# EAGLE design Uniformity Sensor (EAGLE 7.5.0)
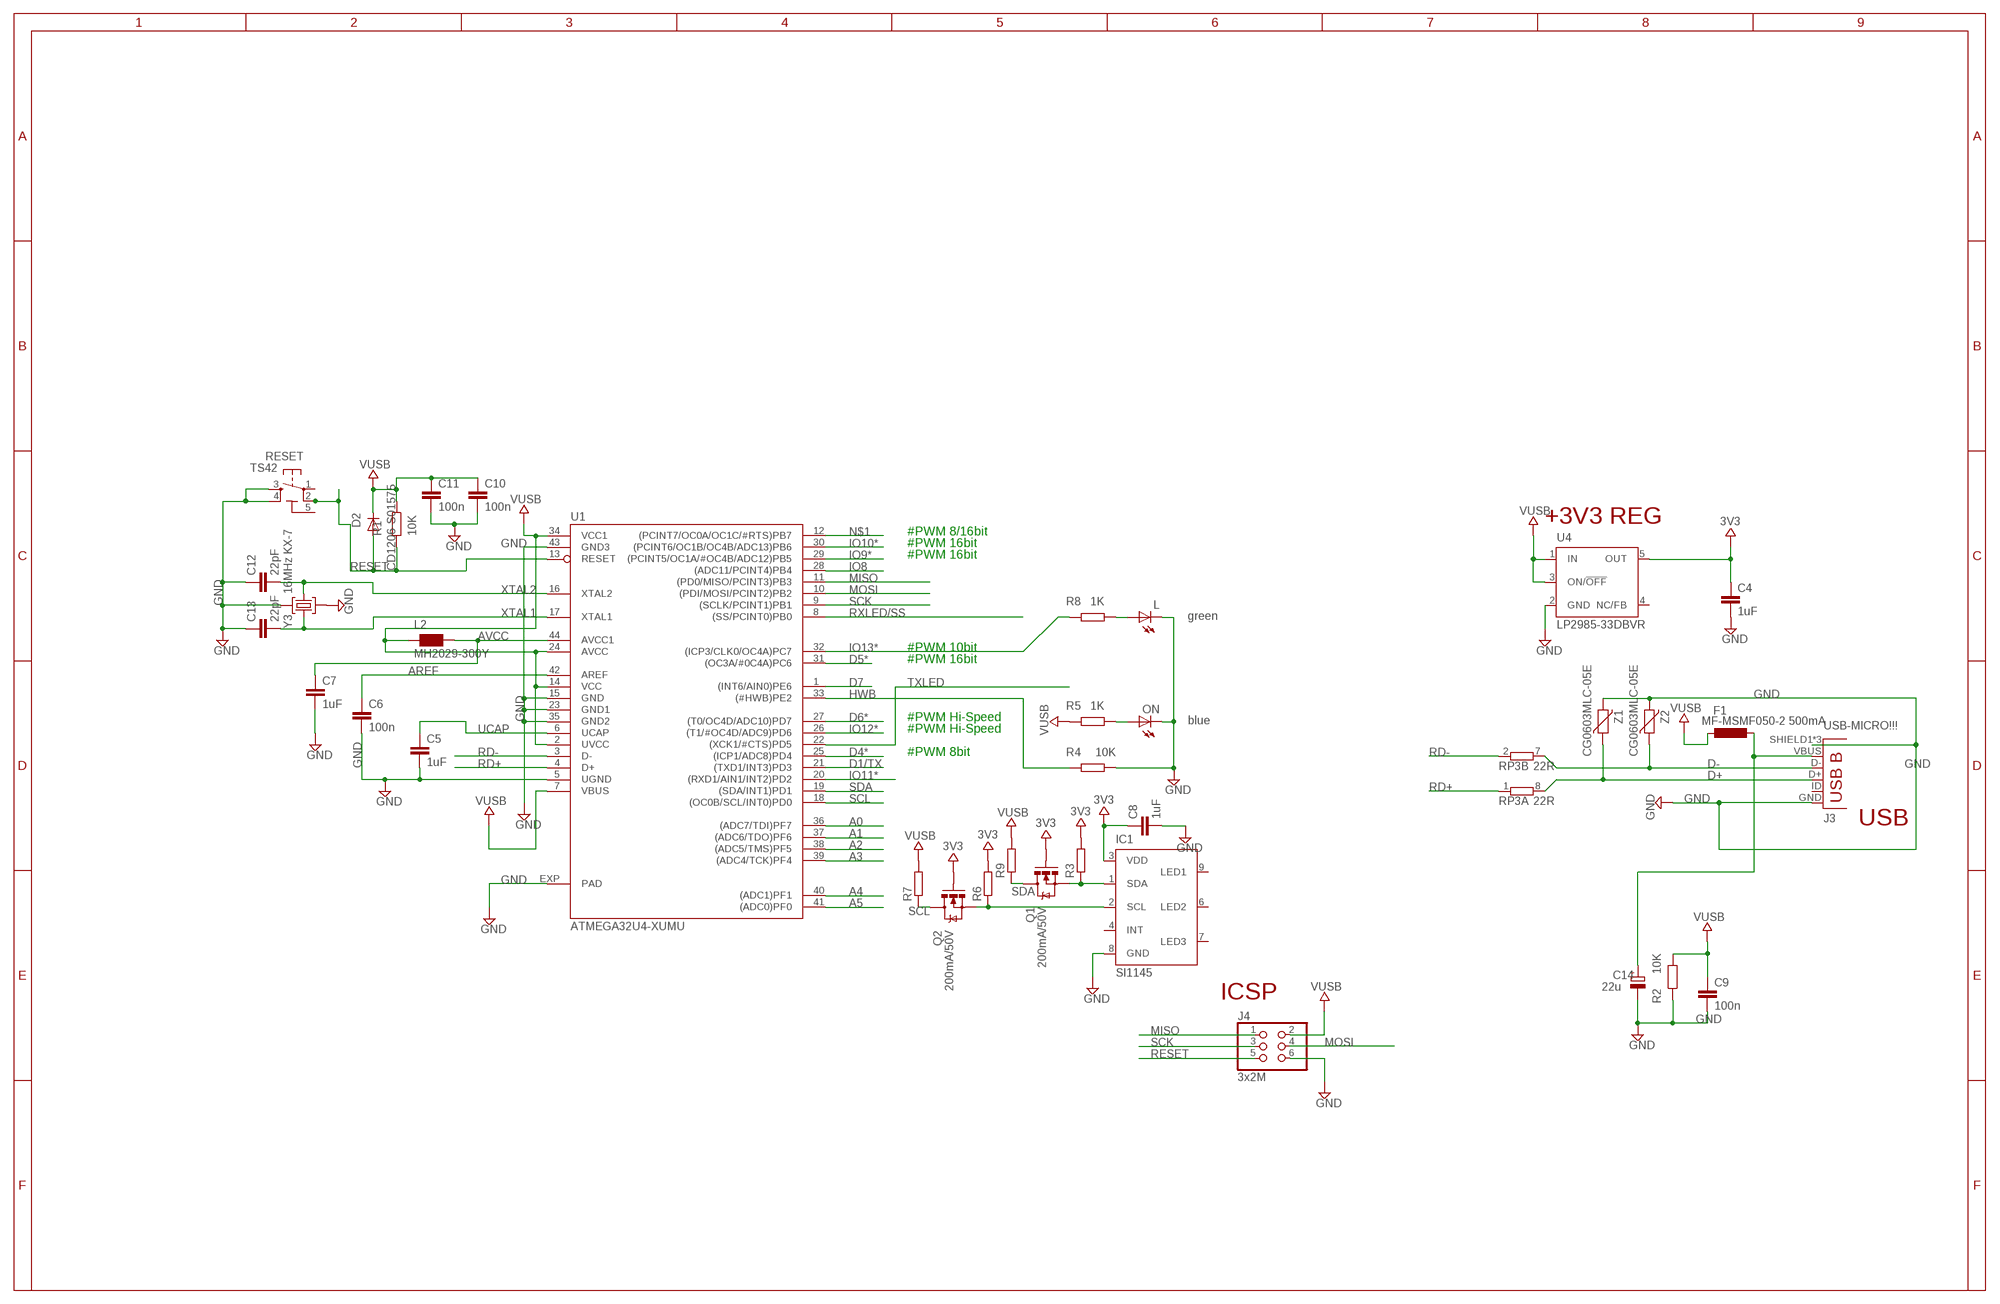
[diagram p0: schematic, sheet 1]

## Parts
C4  1uF  C-EUC0402  [C0402]
C5  1uF  SMARTPRJ_C-EUC0603  [SMARTPRJ_C0603-ROUND]
C6  100n  C-EUC0402  [C0402]
C7  1uF  C-EUC0402  [C0402]
C8  1uF  C-EUC0402  [C0402]
C9  100n  C-EUC0402  [C0402]
C10  100n  C-EUC0402  [C0402]
C11  100n  C-EUC0402  [C0402]
C12  22pF  C-EUC0402  [C0402]
C13  22pF  C-EUC0402  [C0402]
C14  22u  CPOL-EUSMCB  [SMC_B]
D2  CD1206-S01575  DIODE-MINIMELF  [MINIMELF]
F1  MF-MSMF050-2 500mA  L-EUL1812  [L1812]
IC1  SI1145  [QFN-10]
J3  USB-MICRO!!!  USB-MICROB"  [USB-B-MICRO-SMD_V03]
J4  3x2M  PINHD-2X3  [2X03]
L  green  LEDCHIPLED_0805  [CHIPLED_0805]
L2  MH2029-300Y  WE-CBF_0805  [0805]
ON  blue  LEDCHIPLED_0805  [CHIPLED_0805]
Q1  200mA/50V  MOSFET-NCHANNELBSS138  [SOT23-3]
Q2  200mA/50V  MOSFET-NCHANNELBSS138  [SOT23-3]
R1  10K  R-EU_R0402  [R0402]
R2  10K  R-EU_R0402  [R0402]
R3  SMARTPRJ_R-EU_R0402  [SMARTPRJ_R0402]
R4  10K  R-EU_R0402  [R0402]
R5  1K  R-EU_R0402  [R0402]
R6  SMARTPRJ_R-EU_R0402  [SMARTPRJ_R0402]
R7  SMARTPRJ_R-EU_R0603  [SMARTPRJ_R0603-ROUND]
R8  1K  R-EU_R0402  [R0402]
R9  SMARTPRJ_R-EU_R0402  [SMARTPRJ_R0402]
RESET  TS42  [TS42]
RP3  22R  4R-NCAY16  [CAY16]
U1  ATMEGA32U4-XUMU  [QFN44ML7X7]
U4  LP2985-33DBVR  LP2985-XXDBVR33  [SOT23-DBV]
Y3  16MHz KX-7  CRYSTAL-3.2-2.5  [CRYSTAL-3.2-2.5]
Z1  CG0603MLC-05E  VARISTORCN0603  [CT/CN0603]
Z2  CG0603MLC-05E  VARISTORCN0603  [CT/CN0603]

## Nets
3V3: C4.1 C8.1 IC1.3(VDD) Q1.1(G) Q2.1(G) R3.2 R6.2 U4.5(OUT)
A0: U1.36((ADC7/TDI)PF7)
A1: U1.37((ADC6/TDO)PF6)
A2: U1.38((ADC5/TMS)PF5)
A3: U1.39((ADC4/TCK)PF4)
A4: U1.40((ADC1)PF1)
A5: U1.41((ADC0)PF0)
AREF: C6.1 U1.42(AREF)
AVCC: C7.1 L2.2 U1.44(AVCC1)
D1/TX: U1.21((TXD1/INT3)PD3)
D4*: U1.25((ICP1/ADC8)PD4)
D5*: U1.31((OC3A/#0C4A)PC6)
D6*: U1.27((T0/OC4D/ADC10)PD7)
D7: U1.1((INT6/AIN0)PE6)
D+: J3.D+ RP3.8 Z1.1
D-: J3.D- RP3.7 Z2.1
GND: C4.2 C5.2 C6.2 C7.2 C8.2 C9.2 C10.2 C11.2 C12.1 C13.1 C14.- IC1.8(GND) J3.GND J3.SHIELD1(SHIELD) J3.SHIELD2(SHIELD) J3.SHIELD3(SHIELD) J4.6 L.C ON.C R2.1 R4.2 RESET.3 RESET.4 U1.5(UGND) U1.15(GND) U1.23(GND1) U1.35(GND2) U1.43(GND3) U1.EXP(PAD) U4.2(GND) Y3.2(GND) Y3.4(GND) Z1.2 Z2.2
HWB: R4.1 U1.33((#HWB)PE2)
IO8: U1.28((ADC11/PCINT4)PB4)
IO9*: U1.29((PCINT5/OC1A/#OC4B/ADC12)PB5)
IO10*: U1.30((PCINT6/OC1B/OC4B/ADC13)PB6)
IO11*: U1.20((RXD1/AIN1/INT2)PD2)
IO12*: U1.26((T1/#OC4D/ADC9)PD6)
IO13*: R8.1 U1.32((ICP3/CLK0/OC4A)PC7)
MISO: J4.1 U1.11((PD0/MISO/PCINT3)PB3)
MOSI: J4.4 U1.10((PDI/MOSI/PCINT2)PB2)
N$1: U1.12((PCINT7/OC0A/OC1C/#RTS)PB7)
N$2: IC1.1(SDA) Q1.2(S) R3.1
N$3: ON.A R5.2
N$4: IC1.2(SCL) Q2.2(S) R6.1
N$7: L.A R8.2
RD+: RP3.1 U1.4(D+)
RD-: RP3.2 U1.3(D-)
RESET: D2.A J4.5 R1.2 RESET.2 U1.13(RESET)
RXLED/SS: U1.8((SS/PCINT0)PB0)
SCK: J4.3 U1.9((SCLK/PCINT1)PB1)
SCL: Q2.3(D) R7.1 U1.18((OC0B/SCL/INT0)PD0)
SDA: Q1.3(D) R9.1 U1.19((SDA/INT1)PD1)
TXLED: U1.22((XCK1/#CTS)PD5)
UCAP: C5.1 U1.6(UCAP)
VUSB: C9.1 C10.1 C11.1 D2.C F1.2 J4.2 L2.1 R1.1 R2.2 R5.1 R7.2 R9.2 U1.2(UVCC) U1.7(VBUS) U1.14(VCC) U1.24(AVCC) U1.34(VCC1) U4.1(IN) U4.3(ON/!OFF)
VUSBD: C14.+ F1.1 J3.VBUS
XTAL1: C13.2 U1.17(XTAL1) Y3.3(C2)
XTAL2: C12.2 U1.16(XTAL2) Y3.1(C1)
Unconnected: IC1.4(INT) IC1.6(LED2) IC1.7(LED3) IC1.9(LED1) J3.ID(USBID) RESET.1 RP3.3 RP3.4 RP3.5 RP3.6 U4.4(NC/FB)

## Notes on the sheet
- +3V3 REG
- #PWM 8/16bit
- #PWM 16bit
- #PWM 16bit
- #PWM 10bit
- #PWM 16bit
- #PWM Hi-Speed
- #PWM Hi-Speed
- #PWM 8bit
- USB
- ICSP

## Power pins joined to a net without a drawn wire
5-GND: RESET.5(5-GND)

## Library data of the parts
C4 C6-C13 = SmartPrj:C-EU: CAPACITOR, European symbol
C5 = arduino-micro-reference-designArduino_Micro_Rev03j:SMARTPRJ_C-EU: CAPACITOR, European symbol
C14 = rcl:CPOL-EU: POLARIZED CAPACITOR, European symbol
D2 = diode:DIODE-: DIODE
F1 = rcl:L-EU: INDUCTOR, European symbol
IC1 = silabs:SI114*: PROXIMITY/UV/AMBIENT LIGHT SENSOR IC WITH I2C INTERFACE Source: http://www.silabs.com/Support%20Documents/TechnicalDocs/Si1145-46-47.pdf
J3 = SparkFun-Connectors:USB-MICROB; PROD_ID: CONN-11752
J4 = SmartPrj:PINHD-2X3: PIN HEADER
L ON = led:LED: LED OSRAM: - CHIPLED LG R971, LG N971, LY N971, LG Q971, LY Q971, LO R971, LY R971 LH N974, LH R974 LS Q976, LO Q976, LY Q976 LO Q996 - Hyper CHIPLED LW Q18S LB Q993, LB Q99A, LB R99A - SideLED LS A670, LO A670, LY A670, LG A670, LP A670 LB A673, LV A673, LT A673, LW A673 LH A674 LY A675 LS A676, LA A676, LO A676, LY A676, LW A676 LS A679, LY A679, LG A679 - Hyper Micro SIDELED® LS Y876, LA Y876, LO Y876, LY Y876 LT Y87S - SmartLED LW L88C, LW L88S LB L89C, LB L89S, LG L890 LS L89K, LO L89K, LY L89K LS L896, LA L896, LO L896, LY L896 - TOPLED LS T670, LO T670, LY T670, LG T670, LP T670 LSG T670, LSP T670, LSY T670, LOP T670, LYG T670 LG T671, LOG T671, LSG T671 LB T673, LV T673, LT T673, LW T673 LH T674 LS T676, LA T676, LO T676, LY T676, LB T676, LH T676, LSB T676, LW T676 LB T67C, LV T67C, LT T67C, LS T67K, LO T67K, LY T67K, LW E67C LS E67B, LA E67B, LO E67B, LY E67B, LB E67C, LV E67C, LT E67C LW T67C LS T679, LY T679, LG T679 LS T770, LO T770, LY T770, LG T770, LP T770 LB T773, LV T773, LT T773, LW T773 LH T774 LS E675, LA E675, LY E675, LS T675 LS T776, LA T776, LO T776, LY T776, LB T776 LHGB T686 LT T68C, LB T68C - Hyper Mini TOPLED® LB M676 - Mini TOPLED Santana® LG M470 LS M47K, LO M47K, LY M47K Source: http://www.osram.convergy.de LUXEON: - LUMILED® LXK2-PW12-R00, LXK2-PW12-S00, LXK2-PW14-U00, LXK2-PW14-V00 LXK2-PM12-R00, LXK2-PM12-S00, LXK2-PM14-U00 LXK2-PE12-Q00, LXK2-PE12-R00, LXK2-PE12-S00, LXK2-PE14-T00, LXK2-PE14-U00 LXK2-PB12-K00, LXK2-PB12-L00, LXK2-PB12-M00, LXK2-PB14-N00, LXK2-PB14-P00, LXK2-PB14-Q00 LXK2-PR12-L00, LXK2-PR12-M00, LXK2-PR14-Q00, LXK2-PR14-R00 LXK2-PD12-Q00, LXK2-PD12-R00, LXK2-PD12-S00 LXK2-PH12-R00, LXK2-PH12-S00 LXK2-PL12-P00, LXK2-PL12-Q00, LXK2-PL12-R00 Source: www.luxeon.com KINGBRIGHT: KA-3528ASYC Source: www.kingbright.com
L2 = wuerth-elektronik:WE-CBF: SMD EMI Suppression Ferrite Beads - excellent anti-EMI properties - low DCR - impedances till 3000 ohms - rated current up to 6 A
Q1 Q2 = SparkFun-DiscreteSemi:MOSFET-NCHANNEL: Common NMOSFET Parts MFG P/N Store ID Prod ID FDD8780 TRANS-09984 SI7820DN TRANS-11055 FDS6630A IC-08089 2N7002PW TRANS-11151 FQP30N06L COM-10213 TRANS-10060 BSS123LT1G TRANS-08345 BSS138 TRANS-00830 BS170 2N7000; PROD_ID: TRANS-00830
R1 R2 R4 R5 R8 = SmartPrj:R-EU_: RESISTOR, European symbol
R3 R6 R7 R9 = arduino-micro-reference-designArduino_Micro_Rev03j:SMARTPRJ_R-EU_: RESISTOR, European symbol
RESET = SmartPrj:TS42: TS42 Dongnan Electronics Tact switch VDC 12V - 50mA
RP3 = resistor-dil:4R-N: Array Chip Resistor Source: RS Component / Phycomp
U1 = SmartPrj:ATMEGA32U4-XU
U4 = SmartPrj:LP2985-XXDBVR: ULTRALOW-POWER 50-mA LOW-DROPOUT LINEAR REGULATORS 50-mA Low-Dropout Regulator Source: http://focus.ti.com/lit/ds/symlink/tps77001.pdf
Y3 = SmartPrj:CRYSTAL-3.2-2.5
Z1 Z2 = varistor:VARISTOR: VARISTOR

## Net classes
0 default: width 0.254 mm, drill 0.61 mm, clearance 0.203 mm

## Board
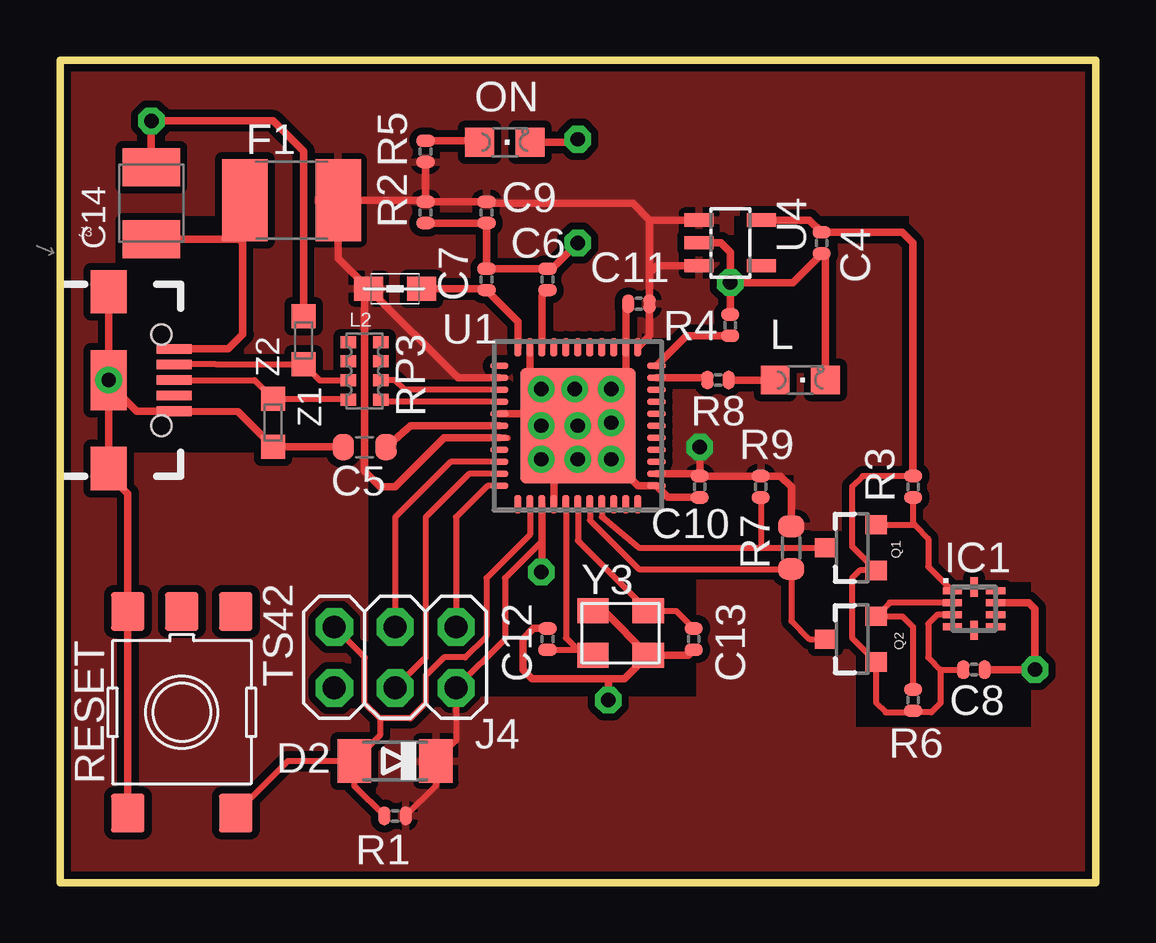
[diagram p1: board, top side]
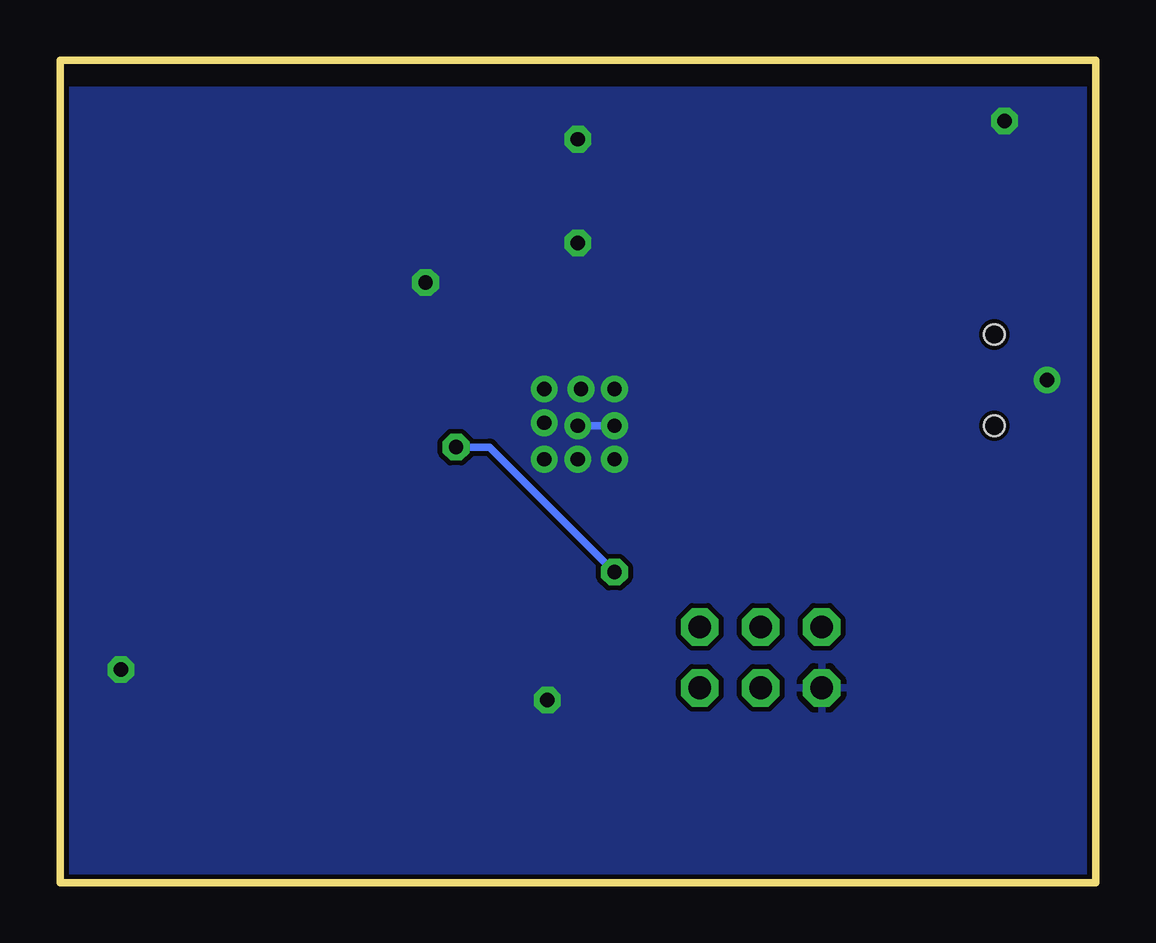
[diagram p2: board, bottom side, seen from below]

Size 43.18 x 34.29 mm. Coordinates in mm from the lower left corner, seen from the top.
Outline: 0,0 0,31.75
Outline: 41.91,0 0,0
Outline: 0,0 0,34.29 43.18,34.29 43.18,0 0,0
Copper layers (1*16): Top 0.035mm / dielectric 1.5mm / Bottom 0.035mm
Design rules "SparkFun": minimum track width 8mil, minimum drill 20mil, track to track 8mil, track to pad 8mil, pad to pad 8mil, via to via 8mil, smd to smd 8mil, copper to edge 8mil, drill to drill 8mil, minimum pad ring 12mil, minimum via ring 10mil, stop-mask expansion 4mil, vias tented up to drill 20mil, thermal gap 10mil

### Footprints (pad centres in the part's own frame; a part is rotated, then mirrored left to right if it is on the bottom)
C0402 = smd 0.508 x 0.762: 1 -0.445,0; 2 0.445,0
SMARTPRJ_C0603-ROUND = smd 0.898 x 1.1: 1 -0.889,0; 2 0.889,0
SMC_B = smd 1.6 x 2.4: + -1.5,0; - 1.5,0
MINIMELF = smd 1.4 x 1.8: A 1.7,0; C -1.7,0
L1812 = smd 1.9 x 3.4: 1 -1.95,0; 2 1.95,0
QFN-10 = smd 0.8 x 0.3: 1 -0.9,0.75; 2 -0.9,0.25; 3 -0.9,-0.25; 4 -0.9,-0.75; 6 0.9,-0.75; 7 0.9,-0.25; 8 0.9,0.25; 9 0.9,0.75 | smd 0.3 x 0.8: 5 0,-0.9; 10 0,0.9
USB-B-MICRO-SMD_V03 = smd 1.45 x 0.4: D+ 2.725,0; D- 2.725,0.65; GND 2.725,-1.3; ID 2.725,-0.65; VBUS 2.725,1.3 | smd 1.5 x 1.8: SHIELD1 0,3.685; SHIELD2 0,-3.685 | smd 1.5 x 2.5: SHIELD3 0,0 | hole 0.85: 2.2,1.9; 2.2,-1.9
2X03 = drill 0.95 pad 1.55 octagon: 1 -2.54,-1.27; 2 -2.54,1.27; 3 0,-1.27; 4 0,1.27; 5 2.54,-1.27; 6 2.54,1.27
CHIPLED_0805 = smd 1.2 x 1.2: A 0,-1.05; C 0,1.05
0805 = smd 1.2 x 1: 1 -1.1,0; 2 1.1,0
SOT23-3 = smd 0.8 x 0.9: 1 -0.95,-1; 2 0.95,-1; 3 0,1.1
R0402 = smd 0.508 x 0.762: 1 -0.445,0; 2 0.445,0
SMARTPRJ_R0402 = smd 0.508 x 0.762: 1 -0.445,0; 2 0.445,0
SMARTPRJ_R0603-ROUND = smd 0.898 x 1.1: 1 -0.889,0; 2 0.889,0
TS42 = smd 1.6 x 1.4: 1 -4.2,2.25; 2 4.2,2.25; 3 -4.2,-2.25; 4 4.2,-2.25; 5 -4.2,0
CAY16 = smd 0.5 x 0.65: 1 -1.2,-0.675; 2 -0.4,-0.675; 3 0.4,-0.675; 4 1.2,-0.675; 5 1.2,0.675; 6 0.4,0.675; 7 -0.4,0.675; 8 -1.2,0.675
QFN44ML7X7 = smd 0.75 x 0.275: 1 -3.275,2.5; 2 -3.275,2; 3 -3.275,1.5; 4 -3.275,1; 5 -3.275,0.5; 6 -3.275,0; 7 -3.275,-0.5; 8 -3.275,-1; 9 -3.275,-1.5; 10 -3.275,-2; 11 -3.275,-2.5; 23 3.275,-2.5; 24 3.275,-2; 25 3.275,-1.5; 26 3.275,-1; 27 3.275,-0.5; 28 3.275,0; 29 3.275,0.5; 30 3.275,1; 31 3.275,1.5; 32 3.275,2; 33 3.275,2.5 | smd 0.275 x 0.75: 12 -2.5,-3.275; 13 -2,-3.275; 14 -1.5,-3.275; 15 -1,-3.275; 16 -0.5,-3.275; 17 0,-3.275; 18 0.5,-3.275; 19 1,-3.275; 20 1.5,-3.275; 21 2,-3.275; 22 2.5,-3.275; 34 2.5,3.275; 35 2,3.275; 36 1.5,3.275; 37 1,3.275; 38 0.5,3.275; 39 0,3.275; 40 -0.5,3.275; 41 -1,3.275; 42 -1.5,3.275; 43 -2,3.275; 44 -2.5,3.275 | smd 4.826 x 4.826: EXP 0,0
SOT23-DBV = smd 0.55 x 1.2: 1 -0.95,-1.3; 2 0,-1.3; 3 0.95,-1.3; 4 0.95,1.3; 5 -0.95,1.3
CRYSTAL-3.2-2.5 = smd 1.3 x 1.05: 1 -1.15,-0.925; 2 1.15,-0.925; 3 1.15,0.925; 4 -1.15,0.925
CT/CN0603 = smd 1 x 1: 1 -1,0; 2 1,0

### Placement (x,y rotation side)
C4  31.75,26.67 270 top
C5  12.7,18.16 180 top
C6  20.32,25.15 90 top
C7  17.78,25.15 90 top
C8  38.1,8.89 0 top
C9  17.78,27.94 270 top
C10  26.67,16.51 270 top
C11  24.13,24.13 180 top
C12  20.32,10.16 270 top
C13  26.42,10.16 90 top
C14  3.81,28.32 90 top
D2  13.97,5.08 180 top
F1  9.65,28.45 0 top
IC1  38.1,11.43 0 top
J3  2.03,20.95 0 top
J4  13.97,9.4 180 top
L  30.86,20.95 270 top
L2  13.97,24.77 0 top
ON  18.54,30.86 270 top
Q1  33.02,13.97 90 top
Q2  33.02,10.16 90 top
R1  13.97,2.79 180 top
R2  15.24,27.94 90 top
R3  35.56,16.51 90 top
R4  27.94,23.24 90 top
R5  15.24,30.48 90 top
R6  35.56,7.62 270 top
R7  30.48,13.97 90 top
R8  27.43,20.95 0 top
R9  29.21,16.51 90 top
RESET  5.08,7.11 270 top
RP3  12.7,21.34 90 top
U1  21.59,19.05 0 top
U4  27.94,26.67 270 top
Y3  23.37,10.41 0 top
Z1  8.89,19.18 270 top
Z2  10.16,22.61 90 top

### Tracks (layer width: path | path; a pad name or v marks a point on that pad's centre or on a via)
3V3
  Top 0.254: R3.2 33.47,16.95 33.02,16.51 33.02,14.02 Q1.1 33.34,13.02 33.02,12.7 33.02,10.21 Q2.1 34.02,7.51 34.42,7.11 35.5,7.11 R6.2 35.62,7.11 36.32,7.11 36.7,7.49 36.7,8.89 | IC1.3 36.58,11.18 36.2,10.79 36.2,9.4 36.7,8.89 | 36.7,8.89 C8.1
  Top 0.305: U4.5 31.24,27.62 C4.1 35.12,27.11 35.56,26.67 R3.2
AREF
  Top 0.305: C6.1 20.09,24.47 U1.42
AVCC
  Top 0.305: L2.2 17.72,24.77 C7.1 19.09,23.39 U1.44
D+
  Top 0.254: J3.D+ 8.11,20.95 Z1.1 12.11,20.18 RP3.8
D-
  Top 0.254: RP3.7 10.83,20.94 Z2.1 6.51,21.61 J3.D-
GND  (via drill 0.6, 0.6 pad 0.3)
  Top 0.305: C14.- v3.81,31.75 8.89,31.75 10.16,30.48 Z2.2 | ON.C 21.46,30.86 v21.59,30.99 | R2.1 C9.2 C7.2 C6.2 20.51,25.59 v21.59,26.67 | C11.2 23.59,24.04 U1.35 23.59,20.57 v22.99,20.57 | R4.2 v27.94,25.02 | U4.2 27.56,26.67 27.94,26.29 v27.94,25.02 | L.C 31.91,26.06 C4.2 30.54,25.02 v27.94,25.02 | C12.1 19.75,10.6 19.3,10.16 19.3,8.89 19.68,8.51 22.86,8.51 | 22.86,8.51 23.54,8.51 Y3.2 | Y3.4 22.67,11.34 Y3.2 | Y3.2 26.19,9.49 C13.1 | U1.5 20.32,19.55 | 20.32,19.55 21.09,19.55 U1.EXP v20.07,20.57 19.59,21.05 U1.43 | IC1.8 40.39,11.68 40.64,11.43 v40.64,8.89 C8.2 | U1.15 20.59,19.28 20.32,19.55 | v22.86,7.62 22.86,8.51 | v22.99,17.65 24.09,16.55 U1.23 25.35,16.07 C10.2 | RESET.4 RESET.3 2.83,16.22 2.03,17.02 J3.SHIELD2 2.03,19.81 2.54,20.32 | C5.2 11.79,18.18 Z1.2 7.43,19.63 J3.GND 3.21,19.66 2.54,20.32 | J3.SHIELD1 J3.SHIELD3 2.03,20.83 2.54,20.32
  Bottom 0.305: v20.07,19.05 U1.EXP
  other vias: 21.59,19.05 21.46,20.57 22.99,19.18 21.59,17.65 20.07,17.65 2.03,20.95
  pour Bottom: 0,33.02 0,0 43.18,0 43.18,33.02
HWB
  Top 0.305: R4.1 26.11,22.8 U1.33
IO13*
  Top 0.305: U1.32 26.89,21.05 R8.1
MISO
  Top 0.254: U1.11 17.82,16.55 16.51,15.24 J4.1
MOSI
  Top 0.254: U1.10 17.05,17.05 15.24,15.24 15.24,9.4 J4.4
N$2
  Top 0.254: Q1.2 35.63,14.92 | 35.63,14.92 36.2,14.35 36.2,13.19 IC1.1 | R3.1 35.56,14.99 35.63,14.92
N$3
  Top 0.305: R5.2 17.43,30.92 ON.A
N$4
  Top 0.254: IC1.2 34.59,11.68 Q2.2 35.12,11.11 35.56,10.67 R6.1
N$7
  Top 0.305: R8.2 L.A
RD+
  Top 0.254: U1.4 13.38,20.05 RP3.1
RD-
  Top 0.254: U1.3 14.38,20.55 13.97,20.95 13.39,20.95 RP3.2
RESET
  Top 0.254: U1.13 19.59,14.51 17.78,12.7 17.78,10.29 16.89,9.4 16,9.4 15.24,8.64 15.24,7.49 14.61,6.86 13.34,6.86 | 13.34,6.86 12.7,7.49 12.7,9.4 J4.5 | 13.34,6.86 13.34,6.14 D2.A | D2.A 12.27,4.05 R1.2 | D2.A 9.5,5.08 RESET.2
SCK
  Top 0.254: U1.9 16.28,17.55 13.97,15.24 J4.3
SCL
  Top 0.254: Q2.3 31.24,10.16 30.48,10.92 R7.1 24.13,13.08 22.09,15.12 U1.18
SDA
  Top 0.254: U1.19 22.59,15.26 24.13,13.97 29.21,13.97 | 29.21,13.97 Q1.3 | R9.1 29.21,13.97
UCAP
  Top 0.305: U1.6 14.61,19.05 C5.1
VUSB  (via drill 0.6)
  Top 0.254: U1.14 20.09,14.25 18.54,12.7 18.54,10.16 J4.2 16.51,5.92 D2.C 15.67,4.05 R1.1 | U1.7 18.66,18.55
  Top 0.305: R7.2 30.48,16.51 30.04,16.95 R9.2 C10.1 26.57,17.05 U1.24 26.67,17.05 v26.67,18.16 | R2.2 15.18,28.45 F1.2 11.6,26.03 L2.1 | R2.2 C9.1 17.84,28.32 23.88,28.32 24.57,27.62 | R2.2 R5.1 | L2.1 16.59,21.05 U1.2 | U1.7 16.01,18.55 13.97,16.51 13.34,16.51 12.7,17.14 12.7,24.77 L2.1 | U1.34 24.57,22.81 C11.1 24.57,25.4 | 24.57,25.4 24.57,27.62 | 24.57,27.62 U4.1 | U4.3 24.89,25.72 24.57,25.4 | U1.14 20.09,12.98 v20.07,12.95
  Bottom 0.305: 20.07,13.08 v20.07,12.95 25.27,18.16 v26.67,18.16
  pour Top (isolate 0.305): 0,34.29 0,27.94 35.56,27.94 35.56,12.7 40.64,12.7 40.64,6.35 33.02,6.35 33.02,12.7 26.67,12.7 26.67,7.62 12.7,7.62 12.7,15.24 12.7,17.78 0,17.78 0,0 43.18,0 43.18,34.29
  pour Top (isolate 0.305): 31.75,26.67 35.56,26.67 35.56,17.78 35.56,16.89 32.77,16.89 32.77,14.61 30.73,14.61 30.73,17.14 25.27,17.14 25.27,21.08 31.5,21.08 31.5,26.67
  pour Top (isolate 0.305): 17.78,27.94 27.94,27.94 27.94,22.86 20.32,22.86 20.32,25.4 17.78,25.4
  pour Top (isolate 0.305): 7.62,27.94 17.78,27.94 17.78,24.13 19.05,22.86 19.05,20.32 8.89,20.32 7.62,21.59
  pour Top (isolate 0.305): 0,27.94 2.54,27.94 2.54,13.97 1.27,13.97 0,13.97
VUSBD
  Top 0.305: 7.62,26.67 7.62,27.94 7.62,28.37 F1.1 | C14.+ 7.47,26.82 7.62,26.67 | J3.VBUS 7.01,22.25 7.62,22.86 7.62,26.67
XTAL1
  Top 0.254: U1.17 21.59,14.27 Y3.3 25.68,11.34 C13.2
XTAL2
  Top 0.254: C12.2 21.59,9.72 | 21.59,9.72 21.99,9.72 Y3.1 | U1.16 21.09,10.22 21.59,9.72